# EasyEDA Pro project LCD_Camera_SD.eprj

# Schematic simpleFOC
Board Name: Board1; Create Date: 2025-11-21; Page Name: MCU_P0; Project Name: LCD_Camera_SD; Schematic Name: simpleFOC; Update Date: 2025-12-01; Company: 嘉立创EDA; Page Size: A4; Version: V1.0
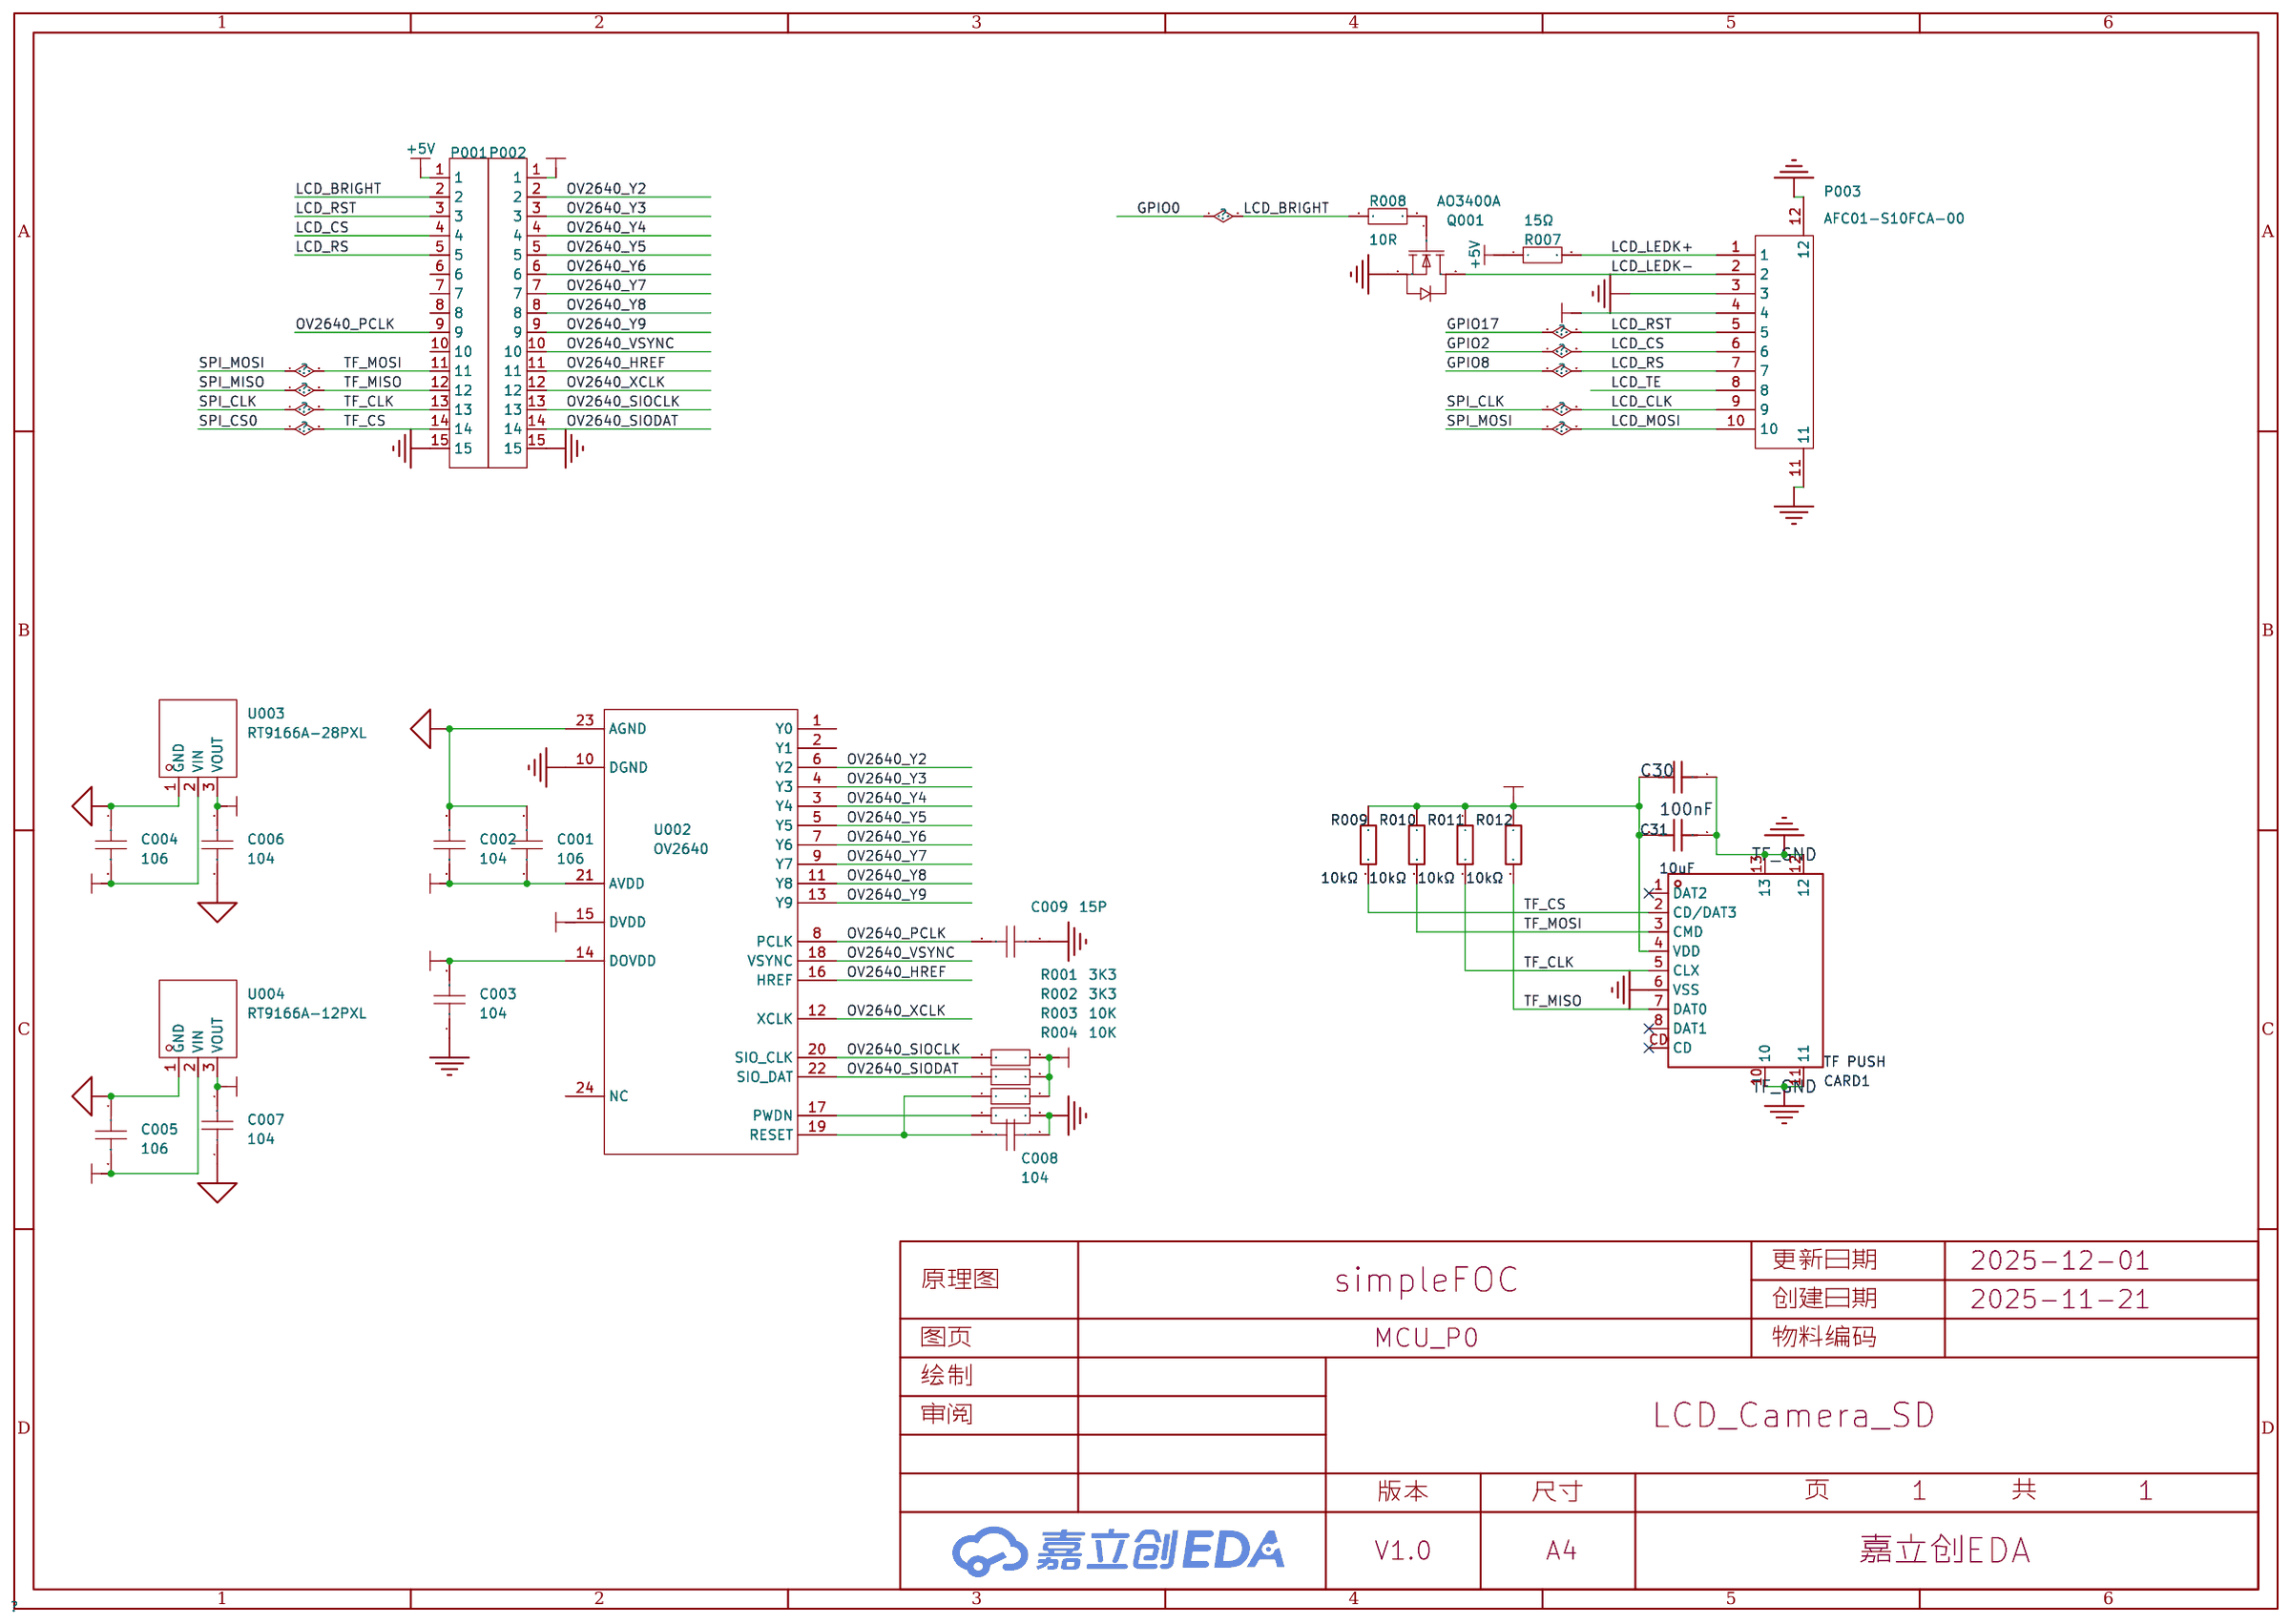
[diagram p0: schematic sheet]

## Parts
C001  100nF  [C0805]
C002  100nF  [C0603]
C003  100nF  [C0603]
C004  100nF  [C0805]
C005  100nF  [C0805]
C006  100nF  [C0603]
C007  100nF  [C0603]
C008  100nF  [C0603]
C009  100nF  [C0603]
C30  100nF  [C0805]
C31  10uF  [C0805]
CARD1  TF PUSH  [TF-SMD_TF-PUSH]
P001  ZX-PZ2.54-1-15PZZ  [goldfinger_15]
P002  ZX-PZ2.54-1-15PZZ  [goldfinger_15]
P003  AFC01-S10FCA-00  [FPC10_S0.5_reverse]
Q001  AO3400A  [SOT-23-3_L2.9-W1.3-P1.90-LS2.4-BR]
R001  10K  [R0603]
R002  10K  [R0603]
R003  10K  [R0603]
R004  10K  [R0603]
R007  15Ω  [R0805]
R008  10K  [R0603]
R009  10kΩ  [R0805]
R010  10kΩ  [R0805]
R011  10kΩ  [R0805]
R012  10kΩ  [R0805]
U002  OV2640  [FPC24_reverse]
U003  RT9166A-28PXL  [SOT-89-3_L4.5-W2.5-P1.50-LS4.2-BR]
U004  RT9166A-12PXL  [SOT-89-3_L4.5-W2.5-P1.50-LS4.2-BR]

## Library data of the parts
C001 C002 C003 C004 C005 C006 C007 C008 C009 = CAP_0603: Supplier Footprint: 0603
C30 = FCC0805B104K500DT: LCSC Part Name: 100nF ±10% 50V; Supplier Part: C5137467; Manufacturer: FOJAN(富捷); Supplier Footprint: 0805; JLCPCB Part Class: Extended Part; Datasheet: https://atta.szlcsc.com/upload/public/pdf/source/20220818/0EB3B7FB2F5648AC16609637FBA7DABE.pdf; Supplier: LCSC; Tolerance: ±10%; Voltage Rating: 50V; Temperature Coefficient: X7R
C31 = CGA0805X5R106K250MT: LCSC Part Name: 10uF ±10% 25V; Supplier Part: C6119887; Manufacturer: HRE(芯声); Supplier Footprint: 0805; JLCPCB Part Class: Extended Part; Supplier: LCSC; Tolerance: ±10%; Voltage Rating: 25V; Temperature Coefficient: X5R
CARD1 = TF PUSH: LCSC Part Name: 自弹式 MicroSD卡(TF卡) 卡座; Supplier Part: C393941; Manufacturer: SHOU HAN(首韩); Supplier Footprint: SMD; JLCPCB Part Class: 扩展库; Datasheet: https://atta.szlcsc.com/upload/public/pdf/source/20191011/C393941_0DDD896EE907FEB750D8B7B8982E2A67.pdf; Supplier: LCSC; Card Connection Mode: 自弹式; Card Type: MicroSD卡(TF卡); Connector Type: 卡座; Additional Card Detection Pins: 无; Maximum Body Height: 2mm; Operating Temperature Range: -20℃~+90℃
P001 P002 = ZX-PZ2.54-1-15PZZ: LCSC Part Name: 1x15P 间距:2.54mm 方针 直插; Supplier Part: C7501269; Manufacturer: Megastar(兆星); Supplier Footprint: 插件,P=2.54mm; JLCPCB Part Class: 扩展库; Datasheet: https://item.szlcsc.com/datasheet/ZX-PZ2.54-1-15PZZ/8582482.html; Supplier: LCSC; Pin Structure: 1x15P; Pitch: 2.54mm; Circluar Pins/Square Pins: 方针; Mounting Type: 直插; Number of Rows: 单排; Number of Pins: 15P; Current Rating: 3A; Length of Mating Pin: 6mm; Insulation Height: 2.5mm; Length of End Connection Pin: 3mm; Contact Material: 黄铜; Contact Plating: 金; Operating Temperature: -40℃~+105℃; Color: 黑色
P003 = AFC01-S10FCA-00: LCSC Part Name: 间距:0.5mm P数:10P 翻盖式 下接; Supplier Part: C262659; Manufacturer: JS(钜硕电子); Supplier Footprint: SMD,P=0.5mm,卧贴; JLCPCB Part Class: 扩展库; Datasheet: https://item.szlcsc.com/datasheet/AFC01-S10FCA-00/253918.html; Supplier: LCSC; Locking Feature: 翻盖式; Contact Type: 下接; Number of Contacts: 10P; Pitch: 0.5mm; Mounting Type: 卧贴; FFC, FCB Thickness: 0.3mm; Height Above Board: 2mm
Q001 = AO3400A_C20917: LCSC Part Name: 1个N沟道 耐压:30V 电流:5.7A; Supplier Part: C20917; Manufacturer: AOS; Supplier Footprint: SOT-23-3L; JLCPCB Part Class: 基础库; Datasheet: https://item.szlcsc.com/datasheet/AO3400A/21629.html; Supplier: LCSC; Drain to Source Voltage: 30V; RDS(on): 48mΩ@2.5V; Gate Threshold Voltage (Vgs(th)): 1.45V@250uA; Gate Charge(Qg): 7nC@10V; Input Capacitance(Ciss): 630pF@15V; Operating Temperature: -55℃~+150℃@(Tj); Type: N沟道
R001 R002 R003 R004 R008 = Res_0603: Supplier Footprint: 0603
R007 = FRC0805F15R0TS: LCSC Part Name: 15Ω ±1% 125mW 厚膜电阻; Supplier Part: C2907229; Manufacturer: FOJAN(富捷); Supplier Footprint: 0805; JLCPCB Part Class: Extended Part; Datasheet: https://item.szlcsc.com/datasheet/FRC0805F15R0TS/3180742.html; Supplier: LCSC; Type: 厚膜电阻; Tolerance: ±1%; Power(Watts): 125mW; Voltage-Supply(Max): 150V; Temperature Coefficient: ±100ppm/℃; Operating Temperature: -55℃~+155℃
R009 R010 R011 R012 = 0805W8F1002T5E_C17414: LCSC Part Name: 10kΩ ±1% 125mW 厚膜电阻; Supplier Part: C17414; Manufacturer: UNI-ROYAL(厚声); Manufacturer Part: 0805W8F1002T5E; Supplier Footprint: 0805; JLCPCB Part Class: Basic Part; Datasheet: https://atta.szlcsc.com/upload/public/pdf/source/20200306/C422600_1E6D84923E4A46A82E41ADD87F860B5C.pdf; Supplier: LCSC; Type: 厚膜电阻; Tolerance: ±1%; Power(Watts): 125mW; Overload Voltage (Max): 150V; Temperature Coefficient: ±100ppm/℃; Operating Temperature Range: -55℃~+155℃
U002 = ov2640
U003 U004 = RT9166A-25GXL: LCSC Part Name: 输入5.5V 输出2.5V 600mA; Supplier Part: C114480; Manufacturer: RICHTEK(立锜); Supplier Footprint: SOT-89-3; JLCPCB Part Class: 扩展库; Datasheet: https://atta.szlcsc.com/upload/public/pdf/source/20170918/C130829_1505703424314975354.pdf; Supplier: LCSC; Output Type: 固定; Voltage - Supply: 5.5V; Output Current: 600mA; Power Supply Rejection Ratio (PSRR): 55dB; Voltage Dropout: 580mV@(600mA); standby current: 220uA; Features: 过流保护；短路保护；过热保护; Operating Temperature: -40℃~+125℃@(Tj); Output Configuration: 正极

## Nets
+1V2: C007.2 U002.15(DVDD) U004.3(VOUT)
+2V8: C001.1 C002.1 C006.2 U002.21(AVDD) U003.3(VOUT)
+3V3: C003.2 C004.2 C005.2 C30.2 C31.2 CARD1.4(VDD) P002.1 P003.4 R001.2 R002.2 R003.2 R009.1 R010.1 R011.1 R012.1 U002.14(DOVDD) U003.2(VIN) U004.2(VIN)
+5V: P001.1 R007.1
AGND: C001.2 C002.2 C004.1 C005.1 C006.1 C007.1 U002.23(AGND) U003.1(GND) U004.1(GND)
GND: C003.1 C008.1 C009.1 CARD1.6(VSS) P001.15 P002.15 P003.3 P003.11 P003.12 Q001.2(S) R004.2 U002.10(DGND)
GPIO0: P001.2 R008.1
GPIO2: P001.4 P003.6
GPIO8: P001.5 P003.7
GPIO17: P001.3 P003.5
LCD_CLK: CARD1.5(CLX) P001.13 P003.9 R011.2
LCD_LEDK+: P003.1 R007.2
LCD_LEDK-: P003.2 Q001.3(D)
LCD_MOSI: CARD1.3(CMD) P001.11 P003.10 R010.2
LCD_TE: P003.8
OV2640_HREF: P002.11 U002.16(HREF)
OV2640_PCLK: C009.2 P001.9 U002.8(PCLK)
OV2640_SIOCLK: P002.13 R001.1 U002.20(SIO_CLK)
OV2640_SIODAT: P002.14 R002.1 U002.22(SIO_DAT)
OV2640_VSYNC: P002.10 U002.18(VSYNC)
OV2640_XCLK: P002.12 U002.12(XCLK)
OV2640_Y2: P002.2 U002.6(Y2)
OV2640_Y3: P002.3 U002.4(Y3)
OV2640_Y4: P002.4 U002.3(Y4)
OV2640_Y5: P002.5 U002.5(Y5)
OV2640_Y6: P002.6 U002.7(Y6)
OV2640_Y7: P002.7 U002.9(Y7)
OV2640_Y8: P002.8 U002.11(Y8)
OV2640_Y9: P002.9 U002.13(Y9)
SPI_CS0: CARD1.2(CD/DAT3) P001.14 R009.2
SPI_MISO: CARD1.7(DAT0) P001.12 R012.2
TF_GND: C30.1 C31.1 CARD1.10 CARD1.11 CARD1.12 CARD1.13
$1N2335: R004.1 U002.17(PWDN)
$1N2339: C008.2 R003.1 U002.19(RESET)
$1N7816: Q001.1(G) R008.2

Not connected (* = marked no-connect by the designer): CARD1 1(DAT2)* 8(DAT1)* CD*; P001 6 7 8 10; U002 1(Y0) 2(Y1) 24(NC)

# Board PCB1
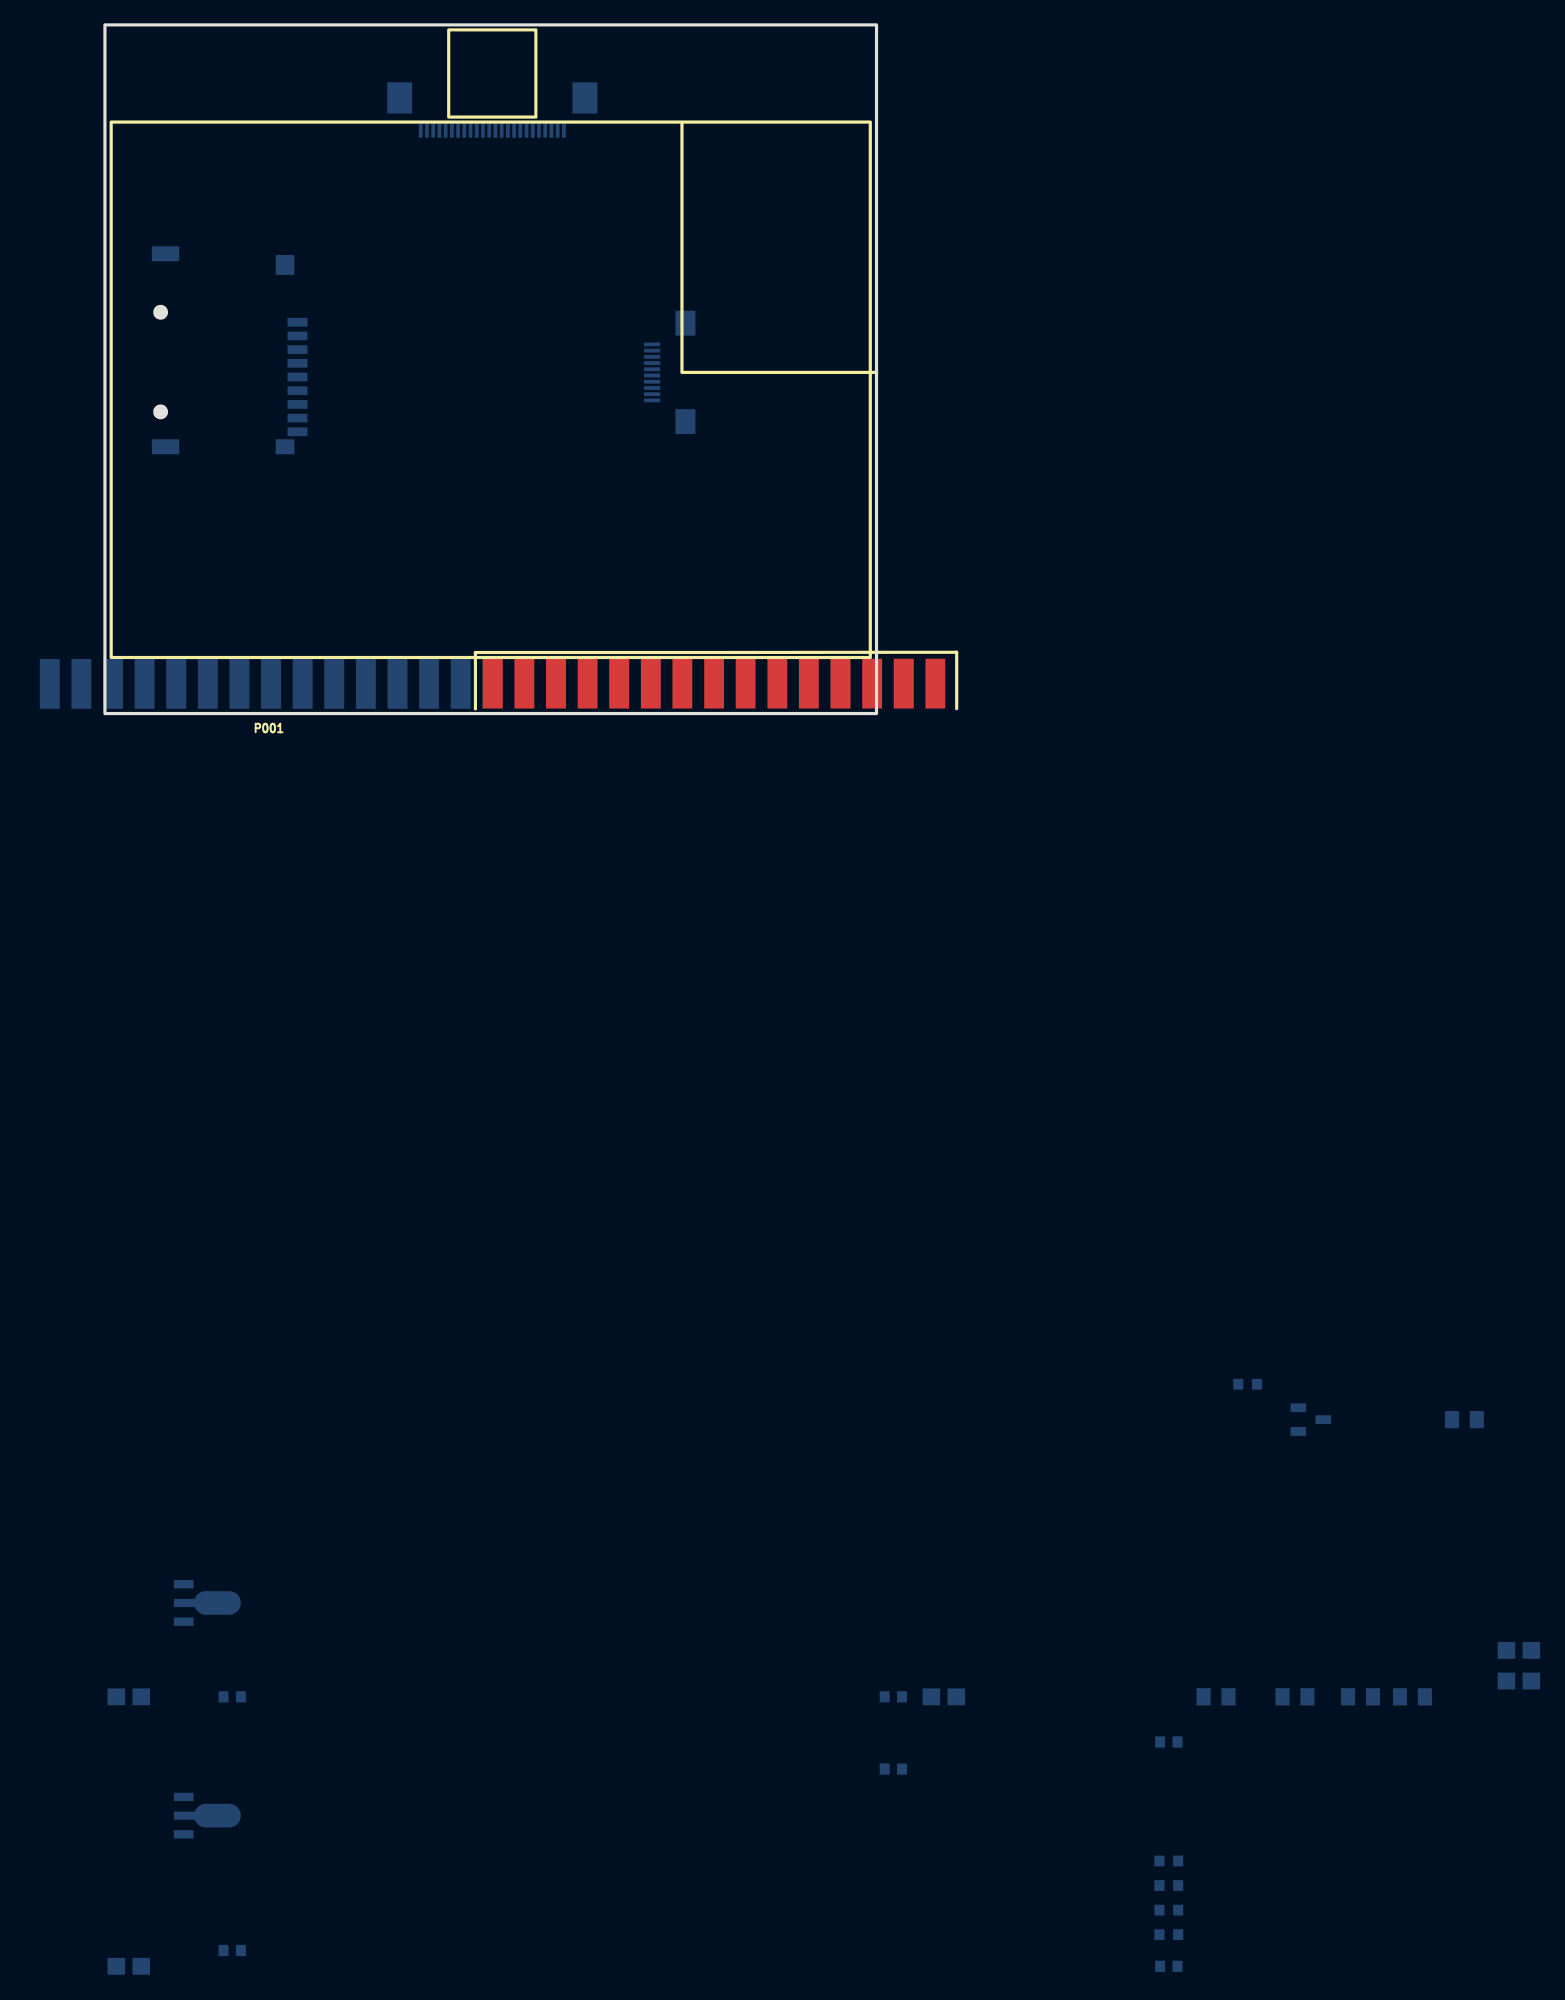
[diagram p1: board, top side]
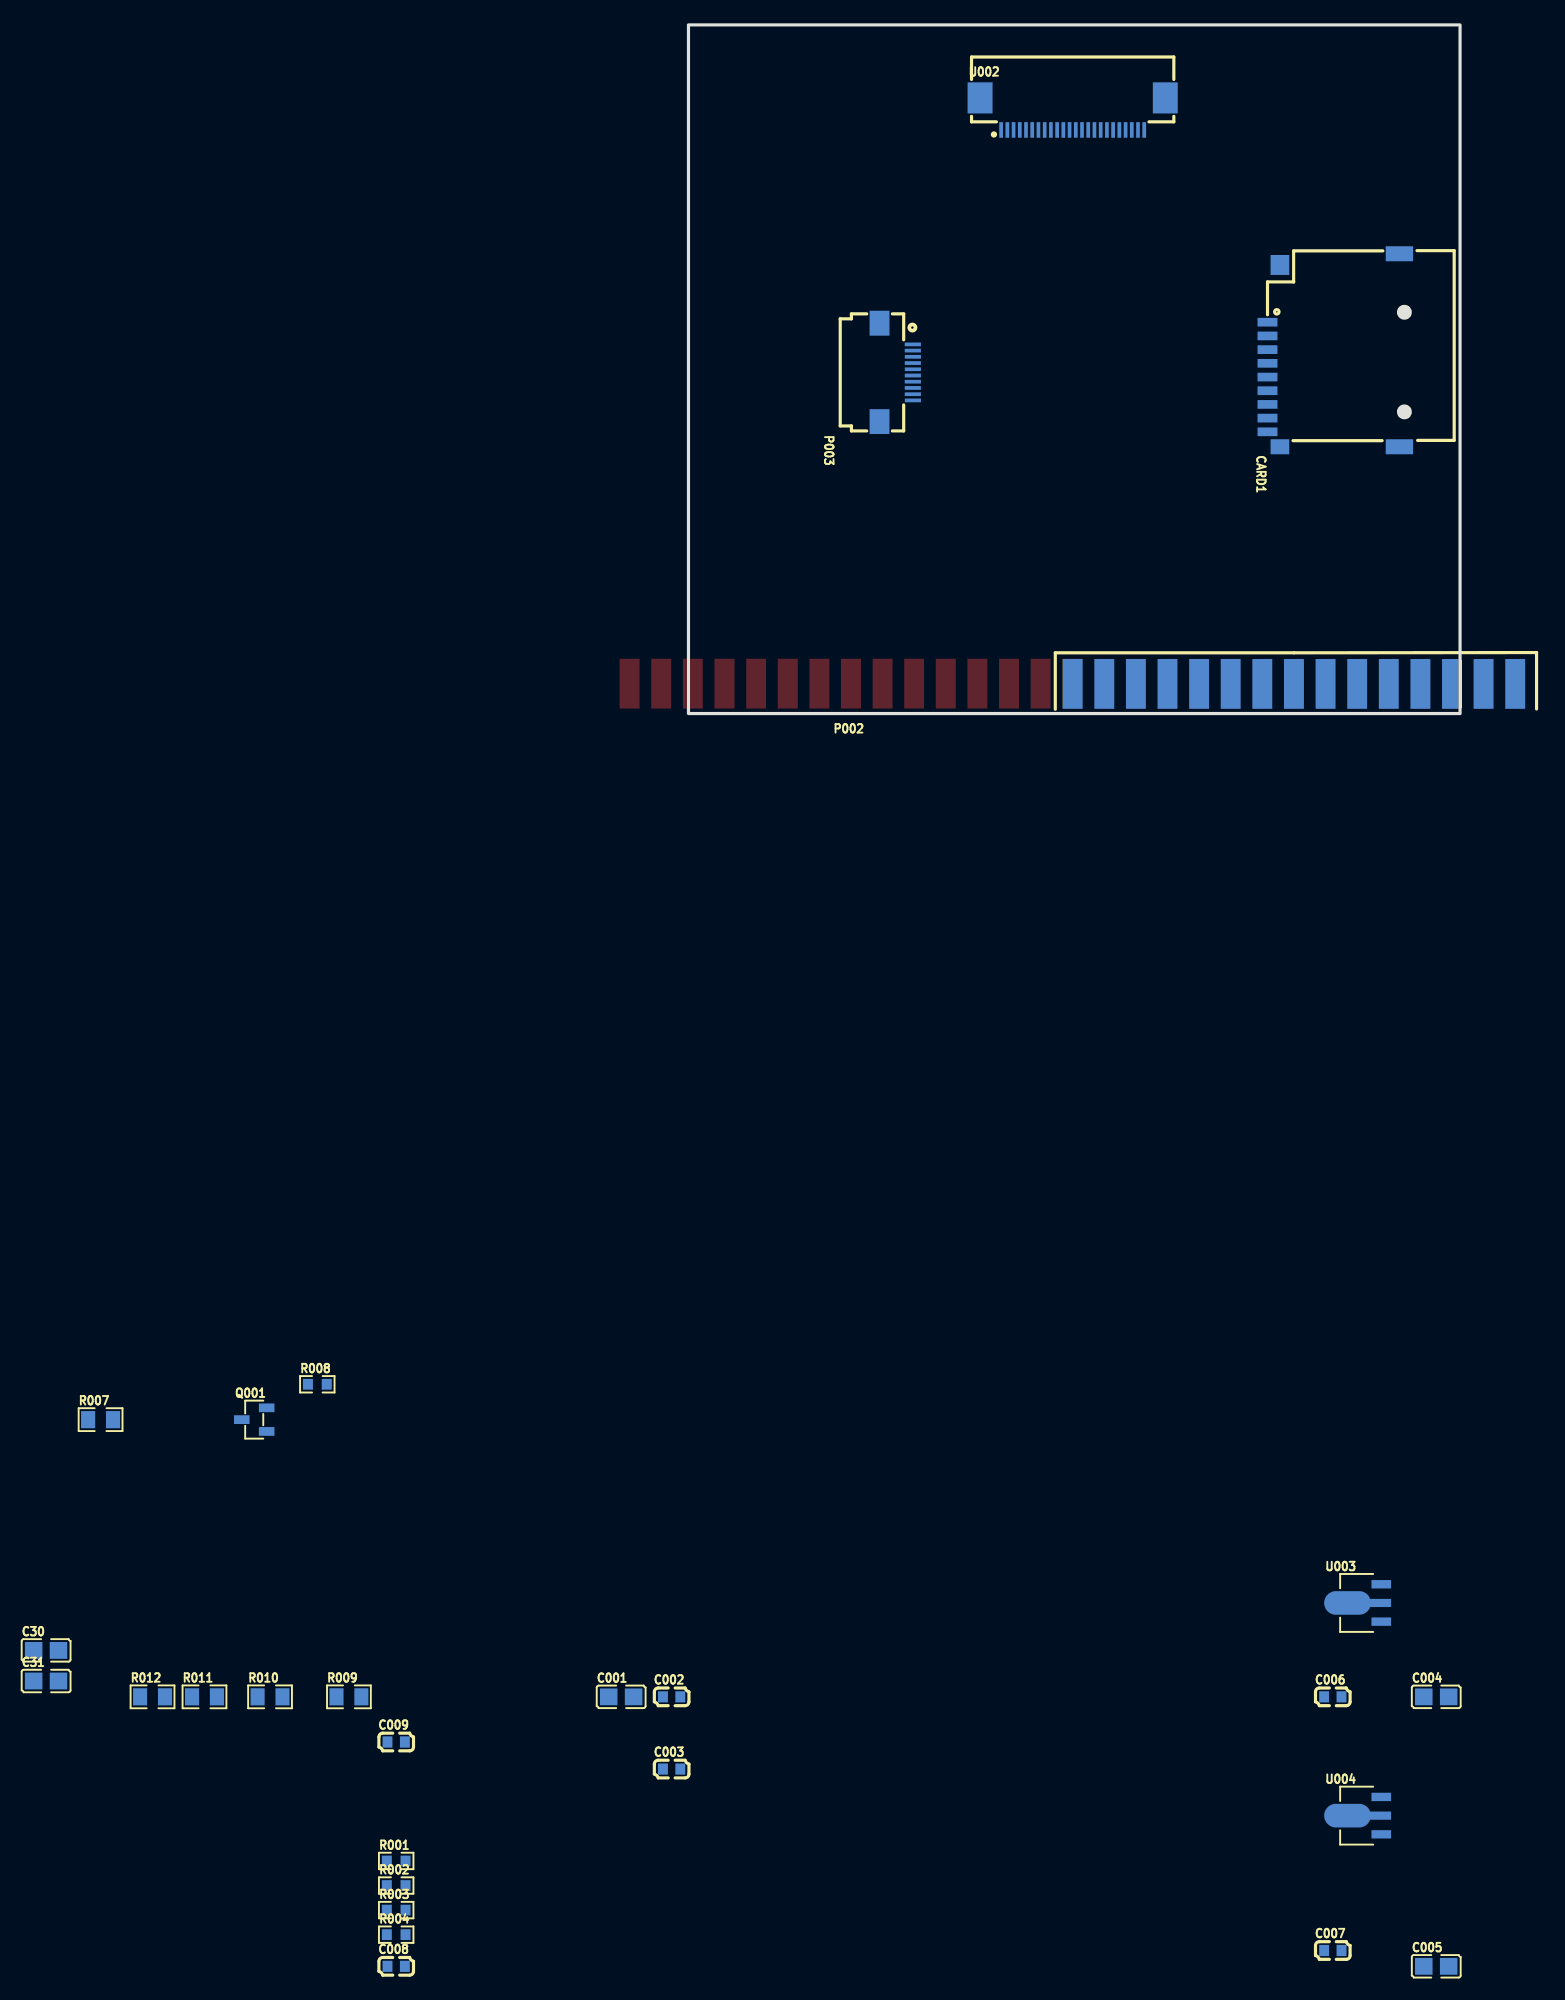
[diagram p2: board, bottom side, seen from below]

Outline 62 x 55.3 mm; copper layers: Top Layer, Bottom Layer. Coordinates in mm from the lower left corner of the outline.
Outline path: rectangle 0,55.3 62,0
Stack: Top Layer 0.035mm / Dielectric1 1.51mm FR4 er 4.5 / Bottom Layer 0.035mm

## Design rules (mm)
template: JLCPCB Capability(Two Layers Board)
spacing copperThickness1oz (default): track to track 0.102, other pairs 0.152 to 0.3
spacing copperThickness2oz: track to track 0.203, other pairs 0.152 to 0.3
track width copperThickness1oz (default): min 0.127, default 0.254, max 2.54
track width copperThickness2oz: min 0.203, default 0.254, max 2.54
differential pair differentialPair (default): width min 0.127, default 0.254, max 2.54; gap min 0.152, default 0.152
via viaSize (default): diameter min 0.5, default 0.61, max 10; hole min 0.3, default 0.305, max 6.3

## Placement (name value [footprint] x y rotation side)
C001  100nF  [C0805]  67.41 -78.96 180 bottom
C002  100nF  [C0603]  63.35 -78.96 180 bottom
C003  100nF  [C0603]  63.35 -84.76 180 bottom
C004  100nF  [C0805]  1.91 -78.96 180 bottom
C005  100nF  [C0805]  1.91 -100.6 180 bottom
C006  100nF  [C0603]  10.23 -78.96 180 bottom
C007  100nF  [C0603]  10.23 -99.33 180 bottom
C008  100nF  [C0603]  85.49 -100.6 180 bottom
C009  100nF  [C0603]  85.49 -82.59 180 bottom
C30  100nF  [C0805]  113.62 -75.23 180 bottom
C31  10uF  [C0805]  113.62 -77.69 180 bottom
CARD1  TF PUSH  [TF-SMD_TF-PUSH]  10.17 29.17 90 bottom
P001  ZX-PZ2.54-1-15PZZ  [goldfinger_15]  31.17 2.4 0 top
P002  ZX-PZ2.54-1-15PZZ  [goldfinger_15]  31.13 2.38 180 bottom
P003  AFC01-S10FCA-00  [FPC10_S0.5_reverse]  46.37 27.4 90 bottom
Q001  AO3400A  [SOT-23-3_L2.9-W1.3-P1.90-LS2.4-BR]  96.89 -56.7 180 bottom
R001  10K  [R0603]  85.49 -92.14 180 bottom
R002  10K  [R0603]  85.49 -94.12 180 bottom
R003  10K  [R0603]  85.49 -96.09 180 bottom
R004  10K  [R0603]  85.49 -98.06 180 bottom
R007  15Ω  [R0805]  109.24 -56.7 180 bottom
R008  10K  [R0603]  91.82 -53.86 180 bottom
R009  10kΩ  [R0805]  89.28 -78.96 180 bottom
R010  10kΩ  [R0805]  95.62 -78.96 180 bottom
R011  10kΩ  [R0805]  100.89 -78.96 180 bottom
R012  10kΩ  [R0805]  105.06 -78.96 180 bottom
U002  OV2640  [FPC24_reverse]  31.13 48.73 180 bottom
U003  RT9166A-28PXL  [SOT-89-3_L4.5-W2.5-P1.50-LS4.2-BR]  7.69 -71.42 180 bottom
U004  RT9166A-12PXL  [SOT-89-3_L4.5-W2.5-P1.50-LS4.2-BR]  7.69 -88.5 180 bottom

## Footprints (pads in the part's own frame, mm; a bottom-side part is the same pattern mirrored in y, then rotated)
C0603
  rect 0.8x0.9 smd: 1(-0.7,0) 2(0.7,0)
C0805
  rect 1.41x1.35 smd: 1(-1,0) 2(1,0)
FPC10_S0.5_reverse
  rect 0.3x1.3 smd: 1(2.25,-2.399) 2(1.75,-2.399) 3(1.25,-2.401) 4(0.75,-2.399) 5(0.25,-2.401) 6(-0.25,-2.399) 7(-0.75,-2.399) 8(-1.25,-2.399) 9(-1.75,-2.399) 10(-2.25,-2.401)
  rect 2x1.6 smd: 11(-3.95,0.28) 12(3.95,0.28)
FPC24_reverse
  rect 0.3x1.25 smd: 1(-5.75,-1.867) 2(-5.25,-1.867) 3(-4.75,-1.867) 4(-4.25,-1.867) 5(-3.75,-1.867) 6(-3.25,-1.867) 7(-2.75,-1.867) 8(-2.25,-1.867) 9(-1.75,-1.867) 10(-1.25,-1.867) 11(-0.75,-1.867) 12(-0.25,-1.867) 13(0.25,-1.867) 14(0.75,-1.867) 15(1.25,-1.867) 16(1.75,-1.867) 17(2.25,-1.867) 18(2.75,-1.867) 19(3.25,-1.867) 20(3.75,-1.867) 21(4.25,-1.867) 22(4.75,-1.867) 23(5.25,-1.867) 24(5.75,-1.867)
  rect 2x2.5 smd: 25(7.44,0.708) 26(-7.44,0.708)
goldfinger_15
  rect 1.6x4 smd: 1(0,0) 2(2.54,0) 3(5.08,0) 4(7.62,0) 5(10.16,0) 6(12.7,0) 7(15.24,0) 8(17.78,0) 9(20.32,0) 10(22.86,0) 11(25.4,0) 12(27.94,0) 13(30.48,0) 14(33.02,0) 15(35.56,0)
R0603
  rect 0.806x0.864 smd: 1(-0.753,0) 2(0.753,0)
R0805
  rect 1.133x1.377 smd: 1(-1,0) 2(1,0)
SOT-23-3_L2.9-W1.3-P1.90-LS2.4-BR
  rect 1.25x0.7 smd: 1(1,-0.95) 2(1,0.95) 3(-1,0)
SOT-89-3_L4.5-W2.5-P1.50-LS4.2-BR
  rect 1.575x0.672 smd: 1(1.356,-1.5) 3(1.356,1.5)
  custom 5.377x1.9 smd: 2(-1.356,0)
TF-SMD_TF-PUSH
  rect 0.7x1.6 smd: 1(2.25,5.3) 2(1.15,5.3) 3(0.05,5.3) 4(-1.05,5.3) 5(-2.15,5.3) 6(-3.25,5.3) 7(-4.35,5.3) 8(-5.45,5.3) CD(-6.55,5.3)
  rect 1.2x1.5 smd: 10(-7.75,4.3)
  rect 1.2x2.2 smd: 11(-7.75,-5.3) 12(7.75,-5.3)
  rect 1.6x1.5 smd: 13(6.85,4.3)

## Nets
As in the schematic.

Pads without a net: CARD1 1 8 CD; P001 6 7 8 10; U002 1 2 24 25 26
